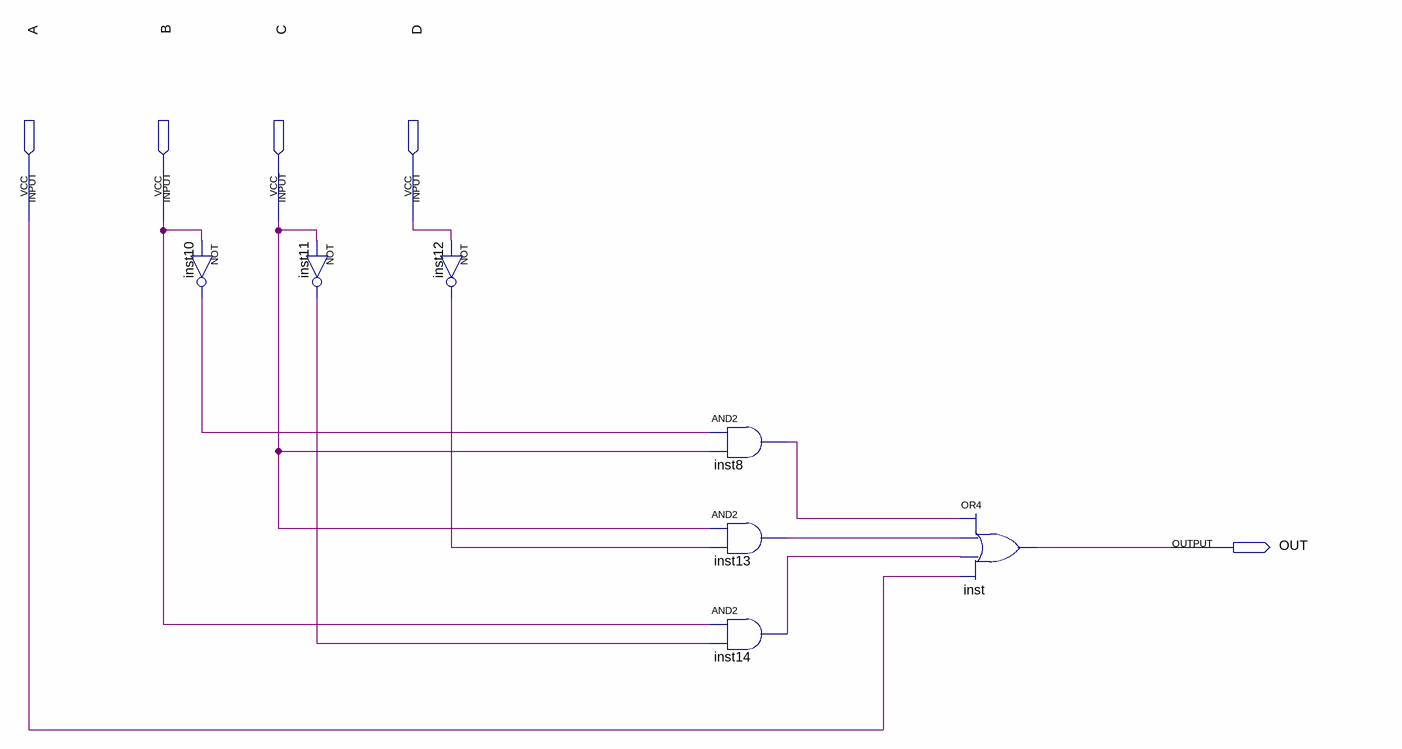
[diagram p0: schematic sheet]
// Quartus schematic ledG.bdf as structural Verilog: 7 symbols, 5 pins
module ledG (
  input  A,
  input  B,
  input  C,
  input  D,
  output OUT
);

  wire inst8_out, inst10_out, inst11_out, inst12_out, inst13_out, inst14_out;

  not inst10 (inst10_out, B);
  not inst11 (inst11_out, C);
  not inst12 (inst12_out, D);
  and inst8 (inst8_out, inst10_out, C);
  and inst13 (inst13_out, C, inst12_out);
  and inst14 (inst14_out, B, inst11_out);
  or inst (OUT, inst8_out, inst13_out, inst14_out, A);
endmodule
